# Altium project loxonext.PrjPcb
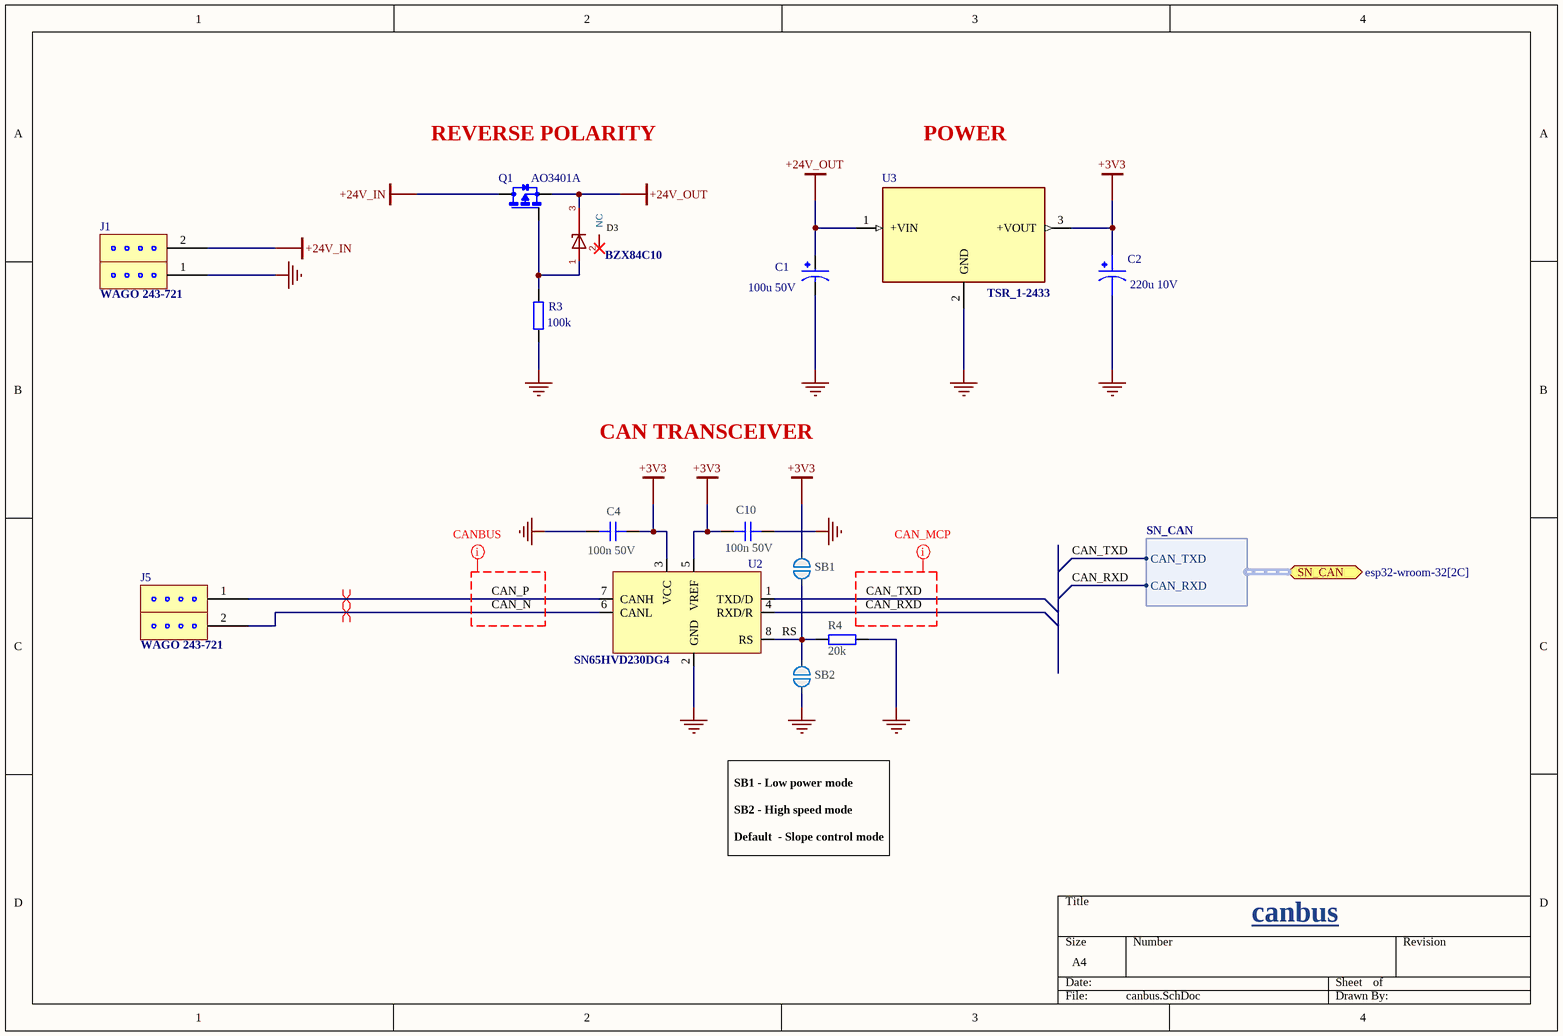
[diagram p0: canbus.SchDoc]
3 sheets, 41 parts. Net scope: flat (ports and power ports of the same name join across sheets).
Board file: loxonext.PcbDoc
Sheets:
  canbus.SchDoc
  rs485.SchDoc
  esp32-wroom-32.SchDoc

## Sheet canbus.SchDoc
size A4; SheetNumber: 1; SheetTotal: 3

### Parts
C1  100u 50V  [CAPPRD500W60D800H1150]
C2  220u 10V  [CAPPM7343X310N]
C4  100n 50V  [CAPC1005X04L]
C10  100n 50V  [CAPC1005X04L]
D3  BZX84C10  [SOT-23]
J1  WAGO 243-721  [243-721]
J5  WAGO 243-721  [243-721]
Q1  AO3401A  [SOT23]
R3  100k  [RES_0603]
R4  20k  [RESC1005X04L]
SB1  Solderbridge  [Solderbridge]  (value not drawn)  (no BOM)
SB2  Solderbridge  [Solderbridge]  (value not drawn)  (no BOM)
U2  SN65HVD230DG4  [SOIC127P599X175-8N]
U3  TSR_1-2433  [TSR-1]

### Ports
SN_CAN (bidir, harness SN_CAN, see esp32-wroom-32[2C])

### Harnesses
SN_CAN: CAN_TXD, CAN_RXD

### Nets
+3V3: C2.1 C4.2 C10.1 SB1.1 U2.3(VCC) U2.5(VREF) U3.3(+VOUT)
+24V_IN: J1.2 Q1.3(D)
+24V_OUT: C1.P D3.3(C) Q1.2(S) U3.1(+VIN)
GND: C1.N C2.2 C4.1 C10.2 J1.1 R3.1 R4.2 SB2.2 U2.2(GND) U3.2(GND)
CAN_N: J5.2 U2.6(CANL)
CAN_P: J5.1 U2.7(CANH)
CAN_RXD: U2.4(RXD/R) ; port SN_CAN.CAN_RXD
CAN_TXD: U2.1(TXD/D) ; port SN_CAN.CAN_TXD
RS: R4.1 SB1.2 SB2.1 U2.8(RS)
NetD3_1: D3.1(A) Q1.1(G) R3.2

Not connected (* = marked no-connect by the designer): D3 2(NC)*

### Layout directives
net class CAN_UART: CAN_RXD, CAN_TXD
net class CANBUS: CAN_N, CAN_P
differential pair: CAN_N, CAN_P

### Notes on the sheet
- REVERSE POLARITY
- POWER
- CAN TRANSCEIVER
- SB1 - Low power mode
  SB2 - High speed mode
  Default  - Slope control mode
- canbus

### Library data of the parts
C1 = ECA1HHG101B: 100F 50V Aluminum Electrolytic Capacitors Radial, Can 1000 Hrs @ 105C; MP: ECA-1HHG101B; MF: Panasonic Electronic; SnapEDA_Link: https://www.snapeda.com/parts/ECA-1HHG101B/Panasonic%20Electronic%20Components/view-part/800817/?ref=snap; Availability: In Stock; Value: *; Price: None; Package: RADIAL-2 Panasonic; Check_prices: https://www.snapeda.com/parts/ECA-1HHG101B/Panasonic%20Electronic%20Components/view-part/800817/?ref=eda
C2 = TPSD227M010R0050: 220 ÂµF Molded Tantalum Capacitors 10 V 2917 (7343 Metric) 50mOhm; MF: AVX; SnapEDA_Link: https://www.snapeda.com/parts/TPSD227M010R0050/AVX/view-part/?ref=snap; Package: 2917 AVX; Value: *; MP: TPSD227M010R0050; Check_prices: https://www.snapeda.com/parts/TPSD227M010R0050/AVX/view-part/?ref=eda
C4 C10 = C0402-4µ7: Capacitor, X5R, ±20%; Manufacturer: N.A.; Part number IPS: 00000001251, 00000007165; Part number NEMS: 100200193; Value: 4.7µF; Note: 10V; Artikkelnr Noca: 20039482; Pad Count: 2; Component Status: Active; Part Number: C0402-4µ7; Manufacturer Part Number: N.A.; ComponentLink1URL: N.A.; ComponentLink1Description: Datasheet; ComponentLink2URL: N.A.; ComponentLink2Description: Supplier link; HelpURL: N.A.; Footprint Doc: 0402; LatestRevisionDate: 2017-11-09; Published: 2009-05-08; Supplier 1: Digi-Key; Supplier Part Number 1: 490-13252-1-ND; Supplier 2: N.A.; Supplier Part Number 2: N.A.; PartId: 100200193; Component Class: Capacitors; Author: rsk; Part number Norautron: N.A.
D3 = BZX84C10: ki_keywords: Zener Dual Diode Common Anode; ki_description: Zener Dual Diode Common Anode
J1 J5 = 243-721: TERM BLOCK PLUG 1POS 5.75MM
Q1 = AO3401A: P-Channel 30 V 4A (Ta) 1.4W (Ta) Surface Mount SOT-23-3; MF: Alpha & Omega Semiconductor; SnapEDA_Link: https://www.snapeda.com/parts/AO3401A/Alpha/view-part/?ref=snap; Package: SOT-23 Alpha &amp; Omega Semiconductor; Value: *; MP: AO3401A; Check_prices: https://www.snapeda.com/parts/AO3401A/Alpha/view-part/?ref=eda
R3 = RES_0603: Resistor SMD 0603; Manufacturer: *; Manufacturer Part Number: *; Distributor Link: *; LCSC: *
R4 = R0402-0R: Resistor, ±5%, 0.063W; Manufacturer: N.A.; Part number IPS: 00000007128; Part number NEMS: 100100109; Value: 0R; Note: Chip Res 5%; Artikkelnr Noca: 27049000; Pad Count: 2; Component Status: Active; Part Number: R0402-0R; Manufacturer Part Number: N.A.; ComponentLink1URL: N.A.; ComponentLink1Description: Datasheet; ComponentLink2URL: N.A.; ComponentLink2Description: Supplier link; HelpURL: N.A.; Footprint Doc: 0402; LatestRevisionDate: 2009-11-23; Published: 2009-05-08; Supplier 1: Farnell; Supplier Part Number 1: 146-9661; Supplier 2: N.A.; Supplier Part Number 2: N.A.; PartId: 100100109; Component Class: Resistors; Author: rsk; Part number Norautron: N.A.
SB1 SB2 = Solderbridge: Manufacturer: N.A.; Part number NEMS: 100500458; Pad Count: 2; Component Status: Active; System: Connector; Part Number: Solderbridge; Manufacturer Part Number: N.A.; LatestRevisionDate: 2009-12-14; Published: 2009-12-14; Value: Solderbridge; Note: N.A.; Artikkelnr Noca: N.A.; Footprint Doc: Solderbridge; Part number IPS: N.A.; ComponentLink1URL: N.A.; ComponentLink1Description: Datasheet; ComponentLink2URL: N.A.; ComponentLink2Description: Supplier link; HelpURL: N.A.; Supplier 1: N.A.; Supplier Part Number 1: N.A.; Supplier 2: N.A.; Supplier Part Number 2: N.A.; PartId: 100500458; Component Class: Connectors; Author: rsk; Part number Norautron: N.A.
U2 = SN65HVD230DG4: 3.3 V CAN Transceiver with Standby Mode 8-SOIC -40 to 85; MF: Texas Instruments; SnapEDA_Link: https://www.snapeda.com/parts/SN65HVD230DG4/Texas+Instruments/view-part/?ref=snap; Package: SOIC-8 Texas Instruments; Value: *; MP: SN65HVD230DG4; Check_prices: https://www.snapeda.com/parts/SN65HVD230DG4/Texas+Instruments/view-part/?ref=eda
U3 = TSR_1-2433: 1 Amp POL switching regulator, 4.6 to -36 VDC input, pos.-pos. circuit, LM78 compatible, SIP-3; MP: TSR 1-2433; MF: Traco Power; Purchase-URL: https://pricing.snapeda.com/search/part/TSR 1-2433/?ref=eda; Package: SIP-3 Traco Power; Availability: In Stock; Value: *; Price: None; SnapEDA_Link: https://www.snapeda.com/parts/TSR%201-2433/Traco%20Power/view-part/6027450/?ref=snap; Check_prices: https://www.snapeda.com/parts/TSR%201-2433/Traco%20Power/view-part/6027450/?ref=eda

## Sheet rs485.SchDoc
size 330 x 190 mm; SheetNumber: 2; SheetTotal: 3
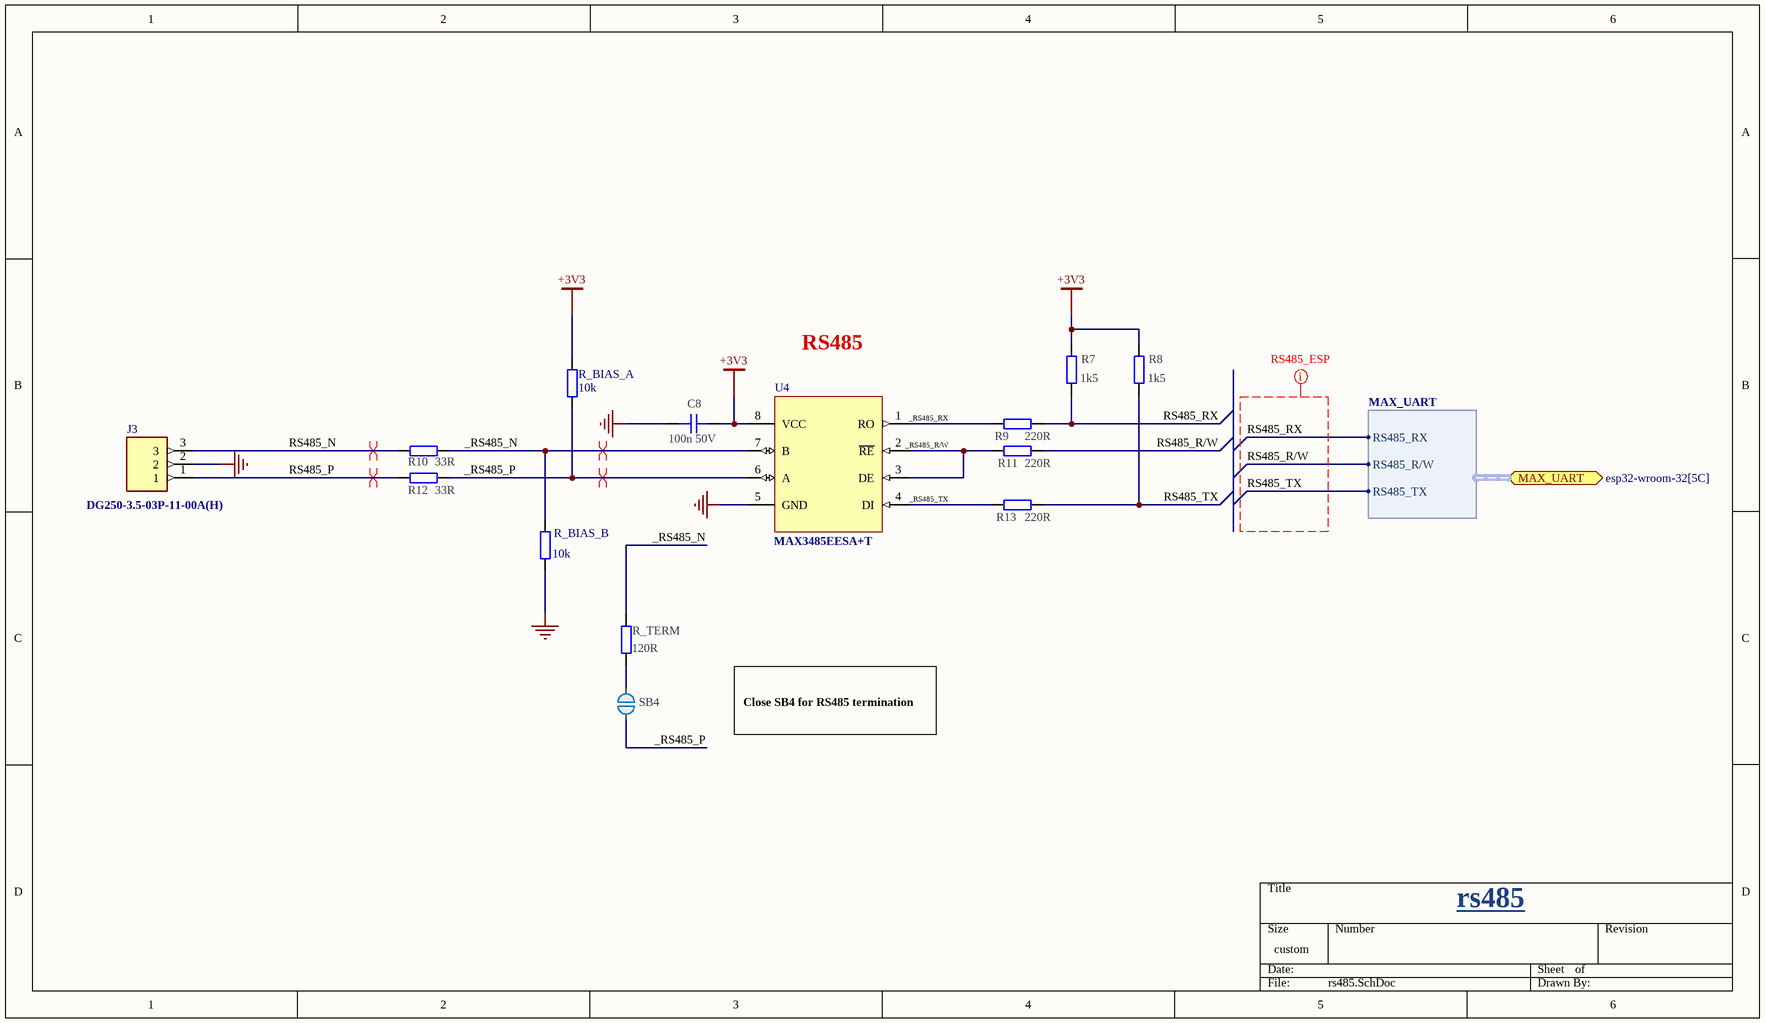
[diagram p1: rs485.SchDoc]

### Parts
C8  100n 50V  [CAPC1005X04L]
J3  DG250-3.5-03P-11-00A(H)  [DG250-3.5-03P-11-00AH]
R7  1k5  [RESC1005X04L]
R8  1k5  [RESC1005X04L]
R9  220R  [RESC1005X04L]
R10  33R  [RESC1005X04L]
R11  220R  [RESC1005X04L]
R12  33R  [RESC1005X04L]
R13  220R  [RESC1005X04L]
R_BIAS_A  10k  [RES_0603]
R_BIAS_B  10k  [RES_0603]
R_TERM  120R  [RESC1005X04L]
SB4  Solderbridge  [Solderbridge]  (value not drawn)  (no BOM)
U4  MAX3485EESA+T  [SOIC127P600X175-8N]

### Ports
MAX_UART (bidir, harness MAX_UART, see esp32-wroom-32[5C])

### Harnesses
MAX_UART: RS485_RX, RS485_R/W, RS485_TX

### Nets
+3V3: C8.2 R7.1 R8.1 R_BIAS_A.2 U4.8(VCC)
GND: C8.1 J3.2 R_BIAS_B.1 U4.5(GND)
_RS485_N: R10.2 R_BIAS_B.2 R_TERM.2 U4.7(B)
_RS485_P: R12.2 R_BIAS_A.1 SB4.2 U4.6(A)
_RS485_R/W: R11.1 U4.2(~{RE}) U4.3(DE)
_RS485_RX: R9.1 U4.1(RO)
_RS485_TX: R13.1 U4.4(DI)
RS485_N: J3.3 R10.1
RS485_P: J3.1 R12.1
RS485_R/W: R11.2 ; port MAX_UART.RS485_R/W
RS485_RX: R7.2 R9.2 ; port MAX_UART.RS485_RX
RS485_TX: R8.2 R13.2 ; port MAX_UART.RS485_TX
NetR_TERM_1: R_TERM.1 SB4.1

### Layout directives
differential pair: _RS485_N, _RS485_P, RS485_N, RS485_P
mark named RS485_ESP: RS485_R/W, RS485_RX, RS485_TX

### Notes on the sheet
- RS485
- Close SB4 for RS485 termination
- rs485

### Library data of the parts
C8 = C0402-4µ7: as C4 on sheet canbus; Part Number: C0402-4µ7; Manufacturer Part Number: N.A.; ComponentLink1URL: N.A.; ComponentLink1Description: Datasheet; ComponentLink2URL: N.A.; ComponentLink2Description: Supplier link; HelpURL: N.A.; Footprint Doc: 0402; LatestRevisionDate: 2017-11-09; Published: 2009-05-08; Supplier 1: Digi-Key; Supplier Part Number 1: 490-13252-1-ND; Supplier 2: N.A.; Supplier Part Number 2: N.A.; PartId: 100200193; Component Class: Capacitors; Author: rsk; Part number Norautron: N.A.
J3 = DG250-3.5-03P-11-00A(H): Terminal block; 3.5mm; with push button; angled 45Â°; ways: 3; 5A; MF: Degson; SnapEDA_Link: https://www.snapeda.com/parts/DG250-3.5-03P-11-00A(H)/Degson/view-part/?ref=snap; Package: None; Value: *; MP: DG250-3.5-03P-11-00A(H); Check_prices: https://www.snapeda.com/parts/DG250-3.5-03P-11-00A(H)/Degson/view-part/?ref=eda
R7-R13 R_TERM = R0402-0R: as R4 on sheet canbus; Part Number: R0402-0R; Manufacturer Part Number: N.A.; ComponentLink1URL: N.A.; ComponentLink1Description: Datasheet; ComponentLink2URL: N.A.; ComponentLink2Description: Supplier link; HelpURL: N.A.; Footprint Doc: 0402; LatestRevisionDate: 2009-11-23; Published: 2009-05-08; Supplier 1: Farnell; Supplier Part Number 1: 146-9661; Supplier 2: N.A.; Supplier Part Number 2: N.A.; PartId: 100100109; Component Class: Resistors; Author: rsk; Part number Norautron: N.A.
R_BIAS_A R_BIAS_B = RES_0603: Resistor SMD 0603; Manufacturer: *; Manufacturer Part Number: *; Distributor Link: *; LCSC: *
SB4 = Solderbridge: as SB1 on sheet canbus; Part Number: Solderbridge; Manufacturer Part Number: N.A.; LatestRevisionDate: 2009-12-14; Published: 2009-12-14; Value: Solderbridge; Note: N.A.; Artikkelnr Noca: N.A.; Footprint Doc: Solderbridge; Part number IPS: N.A.; ComponentLink1URL: N.A.; ComponentLink1Description: Datasheet; ComponentLink2URL: N.A.; ComponentLink2Description: Supplier link; HelpURL: N.A.; Supplier 1: N.A.; Supplier Part Number 1: N.A.; Supplier 2: N.A.; Supplier Part Number 2: N.A.; PartId: 100500458; Component Class: Connectors; Author: rsk; Part number Norautron: N.A.
U4 = MAX3485EESA+T: 3.3V Powered, Â±15kV ESD-Protected, 12Mbps, Slew-Rate-Limited True RS-485/RS-422 Transceivers3.3V ä¾›ç”µã€Â±15kV ESD ä¿æŠ¤ã€12Mbpsã€åŽ‹æ‘†çŽ‡å—é™çš„çœŸæ­£ RS-485/RS-422 æ”¶å‘å™¨; MF: Analog Devices; SnapEDA_Link: https://www.snapeda.com/parts/MAX3485EESA+T/Analog+Devices/view-part/?ref=snap; Package: SOIC-8 Maxim; Value: *; MP: MAX3485EESA+T; Check_prices: https://www.snapeda.com/parts/MAX3485EESA+T/Analog+Devices/view-part/?ref=eda

## Sheet esp32-wroom-32.SchDoc
size 355 x 241 mm; SheetNumber: 3; SheetTotal: 3
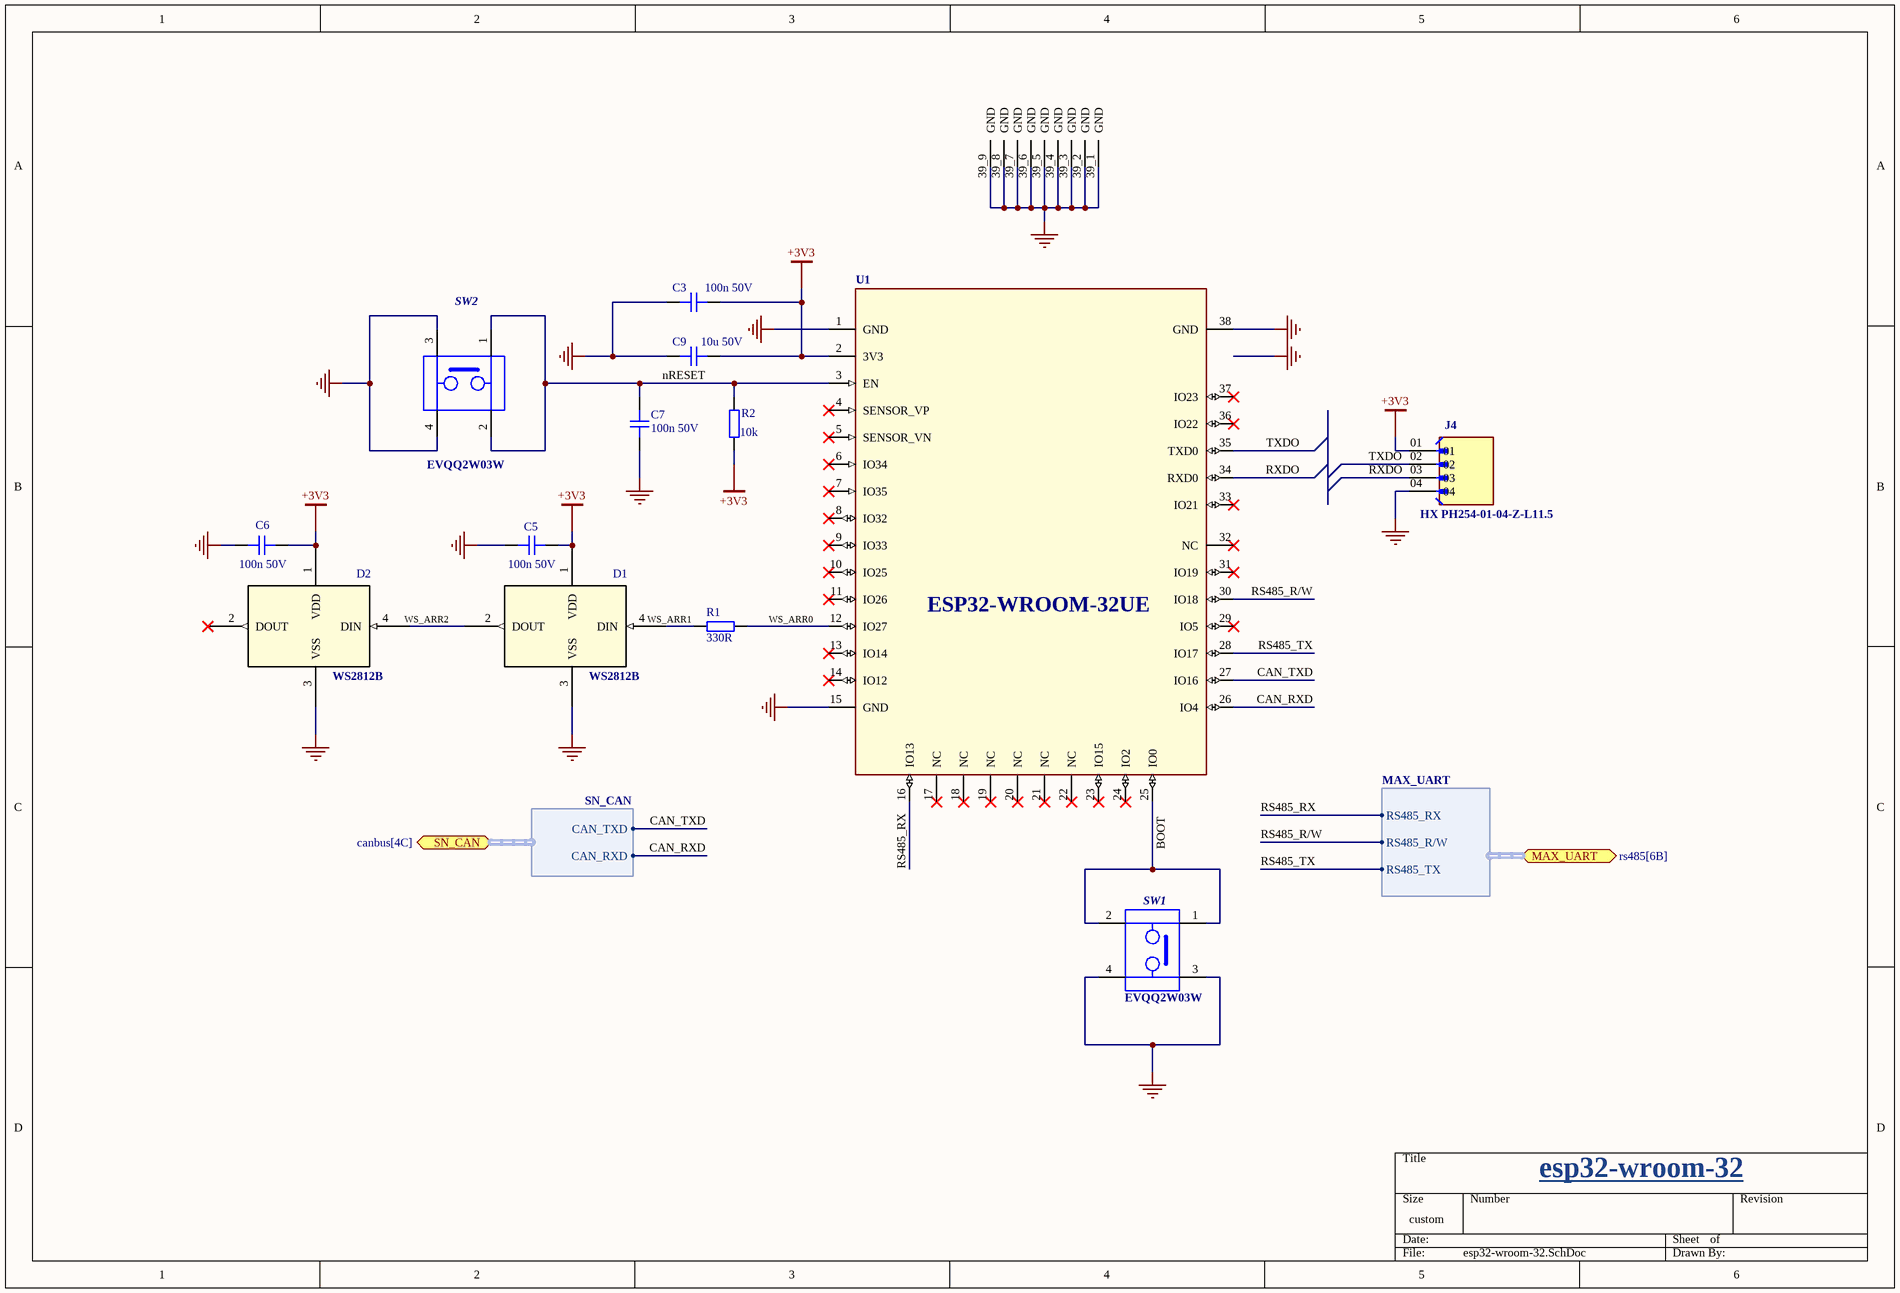
[diagram p2: esp32-wroom-32.SchDoc]

### Parts
C3  100n 50V  [CAP_0603]
C5  100n 50V  [CAP_0603]
C6  100n 50V  [CAP_0603]
C7  100n 50V  [CAP_0805]
C9  10u 50V  [CAP_0603]
D1  WS2812B  [WS2812B_WDS]
D2  WS2812B  [WS2812B_WDS]
J4  HX PH254-01-04-Z-L11.5  [SAMTEC_TSW-104-08-T-S-LL]
R1  330R  [RES_0805]
R2  10k  [RES_0805]
SW1  EVQQ2W03W  [EVQQ2W03W]
SW2  EVQQ2W03W  [EVQQ2W03W]
U1  ESP32-WROOM-32UE  [MODULE_ESP32-WROOM-32UE(M113EH6400UH3Q0)]

### Ports
MAX_UART (bidir, harness MAX_UART, see rs485[6B]), SN_CAN (bidir, harness SN_CAN, see canbus[4C])

### Harnesses
MAX_UART: RS485_RX, RS485_R/W, RS485_TX
SN_CAN: CAN_TXD, CAN_RXD

### Nets
+3V3: C3.2 C5.2 C6.2 C9.2 D1.1(VDD) D2.1(VDD) J4.01 R2.1 U1.2(3V3)
GND: C3.1 C5.1 C6.1 C7.1 C9.1 D1.3(VSS) D2.3(VSS) J4.04 SW1.3 SW1.4 SW2.3 SW2.4 U1.1(GND) U1.15(GND) U1.38(GND) U1.39_1(GND) U1.39_2(GND) U1.39_3(GND) U1.39_4(GND) U1.39_5(GND) U1.39_6(GND) U1.39_7(GND) U1.39_8(GND) U1.39_9(GND)
BOOT: SW1.1 SW1.2 U1.25(IO0)
CAN_RXD: U1.26(IO4) ; port SN_CAN.CAN_RXD
CAN_TXD: U1.27(IO16) ; port SN_CAN.CAN_TXD
nRESET: C7.2 R2.2 SW2.1 SW2.2 U1.3(EN)
RS485_R/W: U1.30(IO18) ; port MAX_UART.RS485_R/W
RS485_RX: U1.16(IO13) ; port MAX_UART.RS485_RX
RS485_TX: U1.28(IO17) ; port MAX_UART.RS485_TX
RXDO: J4.03 U1.34(RXD0)
TXDO: J4.02 U1.35(TXD0)
WS_ARR0: R1.1 U1.12(IO27)
WS_ARR1: D1.4(DIN) R1.2
WS_ARR2: D1.2(DOUT) D2.4(DIN)

Not connected (* = marked no-connect by the designer): D2 2(DOUT)*; U1 4(SENSOR_VP)* 5(SENSOR_VN)* 6(IO34)* 7(IO35)* 8(IO32)* 9(IO33)* 10(IO25)* 11(IO26)* 13(IO14)* 14(IO12)* 17(NC)* 18(NC)* 19(NC)* 20(NC)* 21(NC)* 22(NC)* 23(IO15)* 24(IO2)* 29(IO5)* 31(IO19)* 32(NC)* 33(IO21)* 36(IO22)* 37(IO23)*

### Notes on the sheet
- esp32-wroom-32

### Library data of the parts
C3 C5 C6 C9 = CAP_0603: Capacitor SMD 0603; Manufacturer: *; Manufacturer Part Number: *; Distributor Link: *; LCSC: *; Rating: *; Dielectric: *
C7 = CAP_0805: Capacitor SMD 0805; Manufacturer: *; Manufacturer Part Number: *; Distributor Link: *; LCSC: *; Rating: *; Dielectric: *
D1 D2 = WS2812B: Description; Manufacturer_Name: Worldsemi; Copyright: Copyright (C) 2026 Ultra Librarian. All rights reserved.; Manufacturer_Part_Number: WS2812B; RefDes: RefDes; Type: Type
J4 = 4PIN_TSW-104-08-T-S-LL: MF: Samtec; Availability: Unavailable; Value: *; Package: None; Price: None; MP: TSW-104-08-T-S-LL
R1 R2 = RES_0805: Resistor SMD 0805; Manufacturer: *; Manufacturer Part Number: *; Distributor Link: *; LCSC: *
SW1 SW2 = EVQQ2W03W: White Push Plate Tactile Switch, SPST-NO 20 mA 3.1mm; MF: Panasonic; Package: None; Check_prices: https://www.snapeda.com/parts/EVQQ2W03W/Panasonic/view-part/?ref=eda; SnapEDA_Link: https://www.snapeda.com/parts/EVQQ2W03W/Panasonic/view-part/?ref=snap; Price: None; Availability: In Stock; MP: EVQQ2W03W; Value: *
U1 = ESP32-WROOM-32UE(M113EH6400UH3Q0): Bluetooth, WiFi 802.11b/g/n, Bluetooth v4.2 +EDR, Class 1, 2 and 3 Transceiver Module 2.4GHz ~ 2.5GHz Antenna Not Included, U.FL Surface Mount; MF: Espressif Systems; Price: None; Check_prices: https://www.snapeda.com/parts/ESP32-WROOM-32UE(M113EH6400UH3Q0)/Espressif+Systems/view-part/?ref=eda; Value: *; Package: None; SnapEDA_Link: https://www.snapeda.com/parts/ESP32-WROOM-32UE(M113EH6400UH3Q0)/Espressif+Systems/view-part/?ref=snap; MP: ESP32-WROOM-32UE(M113EH6400UH3Q0); Availability: Not in stock

## Nets that join several sheets
+3V3: canbus (7 pins), rs485 (5 pins), esp32-wroom-32 (9 pins)
GND: canbus (10 pins), rs485 (C8.1 J3.2 R_BIAS_B.1 U4.5), esp32-wroom-32 (24 pins)
CAN_RXD: canbus (U2.4), esp32-wroom-32 (U1.26)
CAN_TXD: canbus (U2.1), esp32-wroom-32 (U1.27)
RS485_R/W: rs485 (R11.2), esp32-wroom-32 (U1.30)
RS485_RX: rs485 (R7.2 R9.2), esp32-wroom-32 (U1.16)
RS485_TX: rs485 (R8.2 R13.2), esp32-wroom-32 (U1.28)